# EAGLE design opemGBZv2 (EAGLE 9.1.0)

## Sheet 1 of 2: Button PCB and Audio
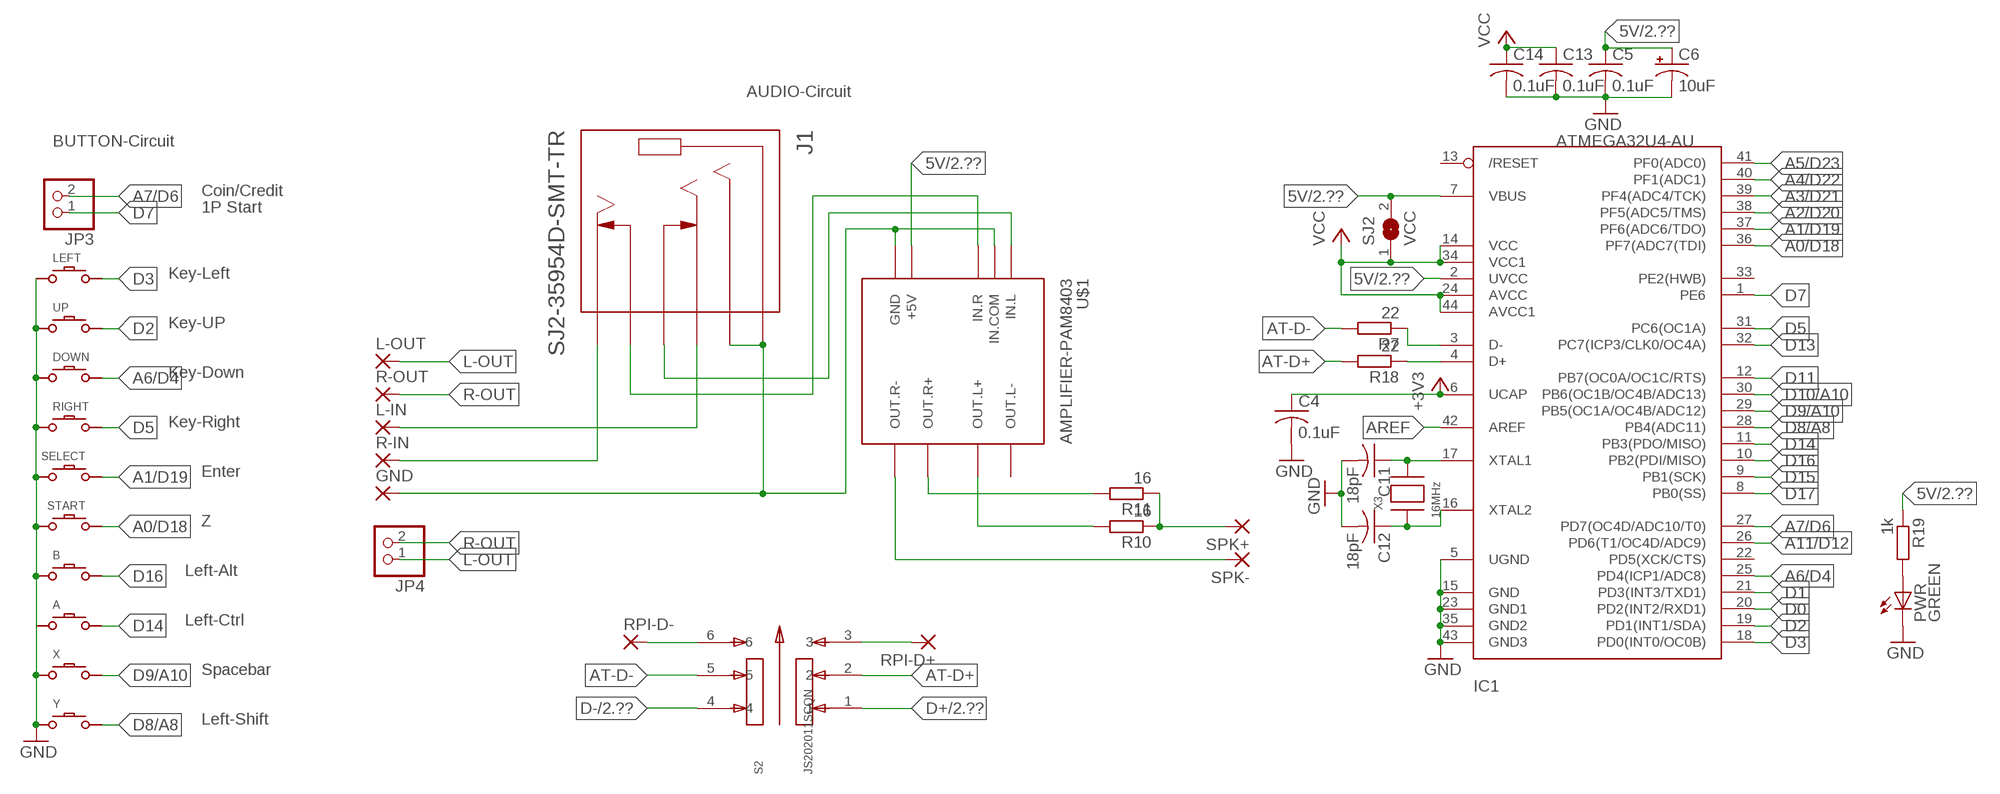
[diagram p0: schematic, sheet 1]

### Parts
A  DMG-BTN  DMG-BTNREGULAR  [DMG-BTN]
B  DMG-BTN  DMG-BTNREGULAR  [DMG-BTN]
C4  0.1uF  C-USC0805K  [C0805K]
C5  0.1uF  C-USC0805K  [C0805K]
C6  10uF  CPOL-USA/3216-18R  [A/3216-18R]
C11  18pF  C-USC0805K  [C0805K]
C12  18pF  C-USC0805K  [C0805K]
C13  0.1uF  C-USC0805K  [C0805K]
C14  0.1uF  C-USC0805K  [C0805K]
DOWN  DMG-BTN  DMG-BTNREGULAR  [DMG-BTN]
GND  WIREPADSMD1,27-254  [SMD1,27-2,54]
IC1  ATMEGA32U4-AU  [TQFP44]
J1  SJ2-35954D-SMT-TR  [CUI_SJ2-35954D-SMT-TR]
JP3  PINHD-1X2  [1X02]
JP4  PINHD-1X2  [1X02]
L-IN  WIREPADSMD1,27-254  [SMD1,27-2,54]
L-OUT  WIREPADSMD1,27-254  [SMD1,27-2,54]
LEFT  DMG-BTN  DMG-BTNREGULAR  [DMG-BTN]
PWR  GREEN  LEDCHIPLED_0805  [CHIPLED_0805]
R7  22  R-EU_R0603  [R0603]
R10  16  R-EU_R0603  [R0603]
R11  16  R-EU_R0603  [R0603]
R18  22  R-EU_R0603  [R0603]
R19  1k  R-EU_R0603  [R0603]
R-IN  WIREPADSMD1,27-254  [SMD1,27-2,54]
R-OUT  WIREPADSMD1,27-254  [SMD1,27-2,54]
RIGHT  DMG-BTN  DMG-BTNREGULAR  [DMG-BTN]
RPI-D+  WIREPADSMD1,27-254  [SMD1,27-2,54]
RPI-D-  WIREPADSMD1,27-254  [SMD1,27-2,54]
S2  JS202011SCQN  [SW_JS202011SCQN]
SELECT  DMG-BTN  DMG-BTNSELECT  [DMG-SEL]
SJ2  VCC  SJ  [SJ]
SPK+  WIREPADSMD1,27-254  [SMD1,27-2,54]
SPK-  WIREPADSMD1,27-254  [SMD1,27-2,54]
START  DMG-BTN  DMG-BTNSELECT  [DMG-SEL]
U$1  AMPLIFIER-PAM8403  [AMPLIFIER-PAM8403]
UP  DMG-BTN  DMG-BTNREGULAR  [DMG-BTN]
X  DMG-BTN  DMG-BTNREGULAR  [DMG-BTN]
X3  16MHz  XTALNX5032  [NX5032]
Y  DMG-BTN  DMG-BTNREGULAR  [DMG-BTN]

### Nets
5V: C5.1 C6.+ IC1.2(UVCC) IC1.7(VBUS) R19.1 SJ2.2 U$1.+5V ; also sheet 2
+3V3: C4.1 IC1.6(UCAP)
A0/D18: IC1.36(PF7(ADC7(TDI)) START.P$1
A1/D19: IC1.37(PF6(ADC6/TDO)) SELECT.P$1
A2/D20: IC1.38(PF5(ADC5/TMS))
A3/D21: IC1.39(PF4(ADC4/TCK))
A4/D22: IC1.40(PF1(ADC1))
A5/D23: IC1.41(PF0(ADC0))
A6/D4: DOWN.P$2 IC1.25(PD4(ICP1/ADC8))
A7/D6: IC1.27(PD7(OC4D/ADC10/T0)) JP3.2
A11/D12: IC1.26(PD6(T1/OC4D/ADC9))
AREF: IC1.42(AREF)
AT-D+: R18.2 S2.2
AT-D-: R7.2 S2.5
D0: IC1.20(PD2(INT2/RXD1))
D1: IC1.21(PD3(INT3/TXD1))
D2: IC1.19(PD1(INT1/SDA)) UP.P$2
D3: IC1.18(PD0(INT0/OC0B)) LEFT.P$2
D5: IC1.31(PC6(OC1A)) RIGHT.P$2
D7: IC1.1(PE6) JP3.1
D8/A8: IC1.28(PB4(ADC11)) Y.P$2
D9/A10: IC1.29(PB5(OC1A/OC4B/ADC12)) X.P$2
D10/A10: IC1.30(PB6(OC1B/OC4B/ADC13))
D11: IC1.12(PB7(OC0A/OC1C/RTS))
D13: IC1.32(PC7(ICP3/CLK0/OC4A))
D14: A.P$2 IC1.11(PB3(PDO/MISO))
D15: IC1.9(PB1(SCK))
D16: B.P$2 IC1.10(PB2(PDI/MISO))
D17: IC1.8(PB0(SS))
D+: S2.1 ; also sheet 2
D-: S2.4 ; also sheet 2
GND: A.P$1 B.P$1 C4.2 C5.2 C6.- C11.2 C12.2 C13.2 C14.2 DOWN.P$1 IC1.5(UGND) IC1.15(GND) IC1.23(GND1) IC1.35(GND2) IC1.43(GND3) LEFT.P$1 PWR.C RIGHT.P$1 SELECT.P$2 START.P$2 UP.P$1 X.P$1 Y.P$1 ; also sheet 2
L-OUT: JP4.1 L-OUT.1(P)
N$1: RPI-D-.1(P) S2.6
N$2: RPI-D+.1(P) S2.3
N$21: R11.2 U$1.OUT.R+
N$22: GND.1(P) J1.1(SLEEVE) J1.4(RING2) U$1.GND U$1.IN.COM
N$23: J1.11(RING1_SWITCH) U$1.IN.L
N$24: J1.10(TIP_SWITCH) U$1.IN.R
N$25: J1.2(TIP) R-IN.1(P)
N$26: J1.3(RING1) L-IN.1(P)
N$27: R10.2 U$1.OUT.L+
N$28: R10.1 R11.1 SPK+.1(P)
N$29: SPK-.1(P) U$1.OUT.R-
N$41: IC1.3(D-) R7.1
N$42: IC1.4(D+) R18.1
N$43: C12.1 IC1.16(XTAL2) X3.P$1
N$44: C11.1 IC1.17(XTAL1) X3.P$2
N$45: PWR.A R19.2
R-OUT: JP4.2 R-OUT.1(P)
VCC: C13.1 C14.1 IC1.14(VCC) IC1.24(AVCC) IC1.34(VCC1) IC1.44(AVCC1) SJ2.1 ; also sheet 2
Unconnected: IC1.13(/RESET) IC1.22(PD5(XCK/CTS)) IC1.33(PE2(HWB)) U$1.OUT.L-

### Notes on the sheet
- AUDIO-Circuit
- BUTTON-Circuit
- Coin/Credit
- 1P Start
- Key-Left
- Key-UP
- Key-Down
- Key-Right
- Enter
- Z
- Left-Alt
- Left-Ctrl
- Spacebar
- Left-Shift

## Sheet 2 of 2: Batterie Charging/Boosting/Protection
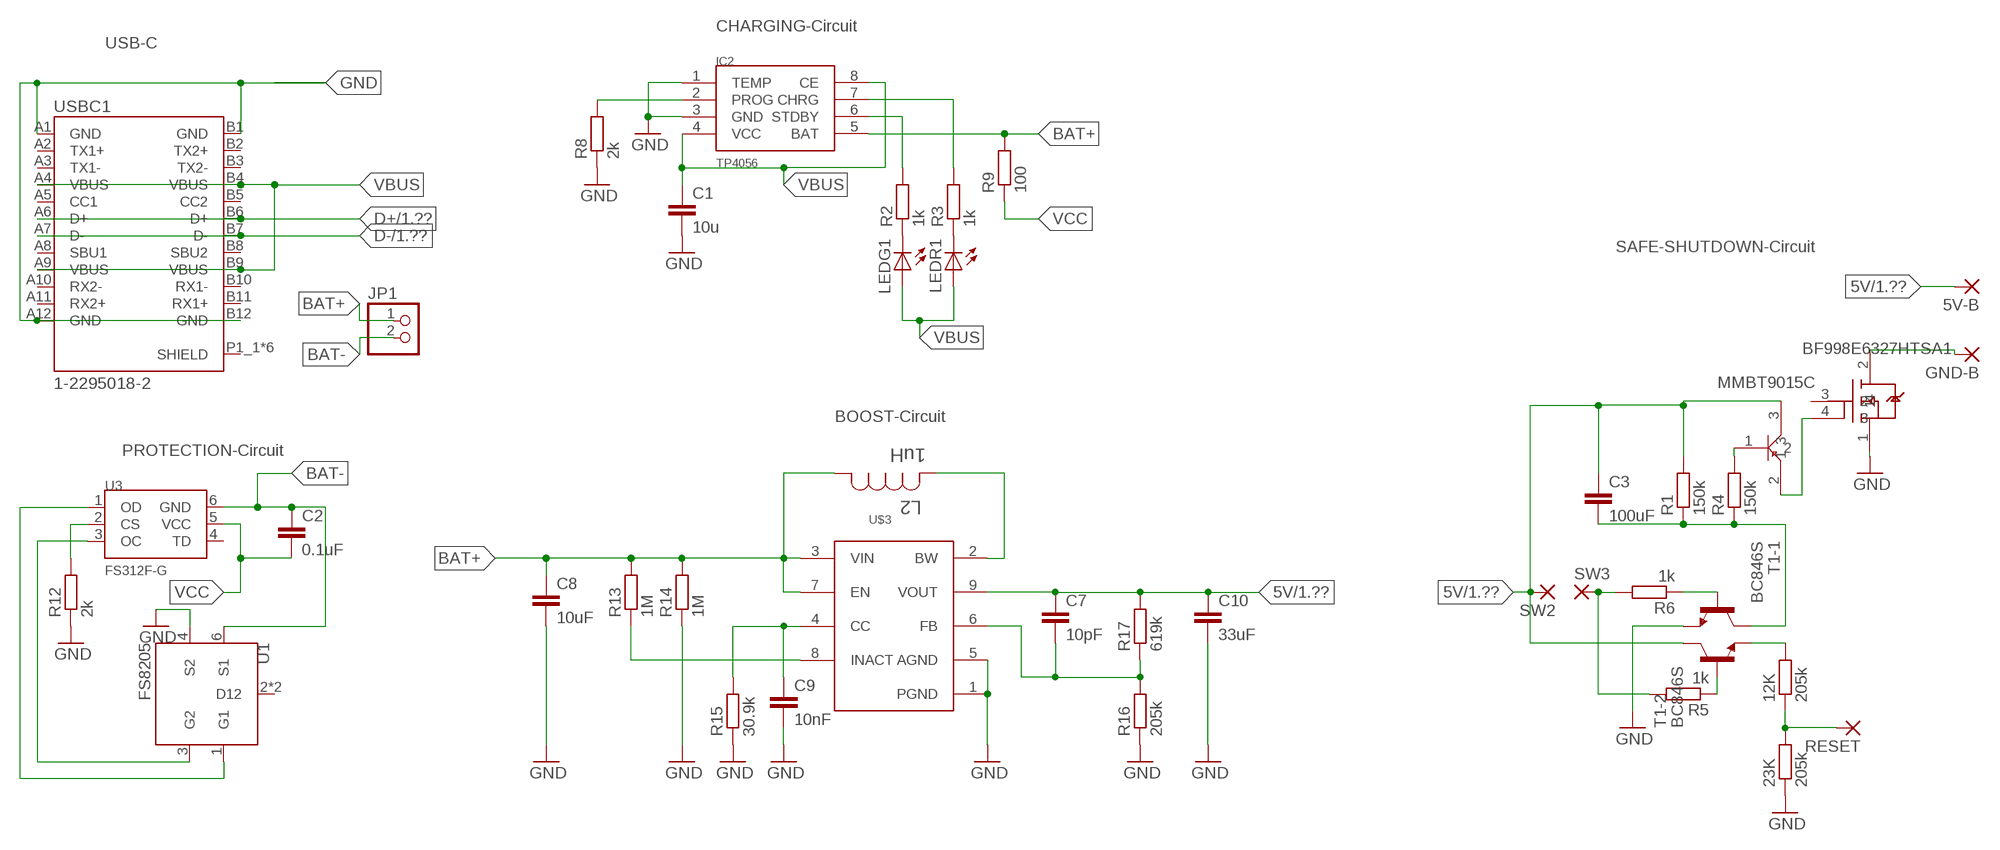
[diagram p1: schematic, sheet 2]

### Parts
5V-B  WIREPADSMD1,27-254  [SMD1,27-2,54]
12K  205k  R-EU_R0603  [R0603]
23K  205k  R-EU_R0603  [R0603]
BF998E6327HTSA1  INF-SOT143-4-1_V_1  [INF-SOT143-4-1_V_1PRIMARY]
C1  10u  C-EUC0603  [C0603]
C2  0.1uF  C-EUC0603  [C0603]
C3  100uF  C-EUC1812  [C1812]
C7  10pF  C-EUC1812  [C1812]
C8  10uF  C-EUC1812  [C1812]
C9  10nF  C-EUC1812  [C1812]
C10  33uF  C-EUC1812  [C1812]
GND-B  WIREPADSMD1,27-254  [SMD1,27-2,54]
IC2  TP4056  [SOP-8]
JP1  PINHD-1X2  [1X02]
L2  1uH  DR74-220-R  [INDM7676X435N]
LEDG1  LEDCHIP-LED0603  [CHIP-LED0603]
LEDR1  LEDCHIP-LED0603  [CHIP-LED0603]
MMBT9015C  INF-SOT23_M_1  [INF-SOT23_M_1PRIMARY]
R1  150k  R-EU_R0603  [R0603]
R2  1k  R-EU_R0603  [R0603]
R3  1k  R-EU_R0603  [R0603]
R4  150k  R-EU_R0603  [R0603]
R5  1k  R-EU_R0603  [R0603]
R6  1k  R-EU_R0603  [R0603]
R8  2k  R-EU_R0603  [R0603]
R9  100  R-EU_R0603  [R0603]
R12  2k  R-EU_R0603  [R0603]
R13  1M  R-EU_R0603  [R0603]
R14  1M  R-EU_R0603  [R0603]
R15  30.9k  R-EU_R0603  [R0603]
R16  205k  R-EU_R0603  [R0603]
R17  619k  R-EU_R0603  [R0603]
RESET  WIREPADSMD1,27-254  [SMD1,27-2,54]
SW2  WIREPADSMD1,27-254  [SMD1,27-2,54]
SW3  WIREPADSMD1,27-254  [SMD1,27-2,54]
T1  BC846S  [SOT363]
U1  FS8205  [SOT23-6]
U3  FS312F-G  [SOT23-6]
U$3  TPS61235RWLR  CONV_TPS61235RWLR  [CONV_TPS61235RWLR]
USBC1  1-2295018-2  [TE_1-2295018-2]

### Nets
5V: 5V-B.1(P) C3.1 C7.1 C10.1 MMBT9015C.3 R1.2 R17.2 SW2.1(P) T1.3(-2:C) U$3.9(VOUT) ; also sheet 1
BAT+: C8.1 IC2.5(BAT) JP1.1 L2.1 R9.2 R13.2 R14.2 U$3.3(VIN) U$3.7(EN)
BAT-: C2.1 JP1.2 U1.6(S1) U3.6(GND)
D+: USBC1.A6(D+) USBC1.B6(D+) ; also sheet 1
D-: USBC1.A7(D-) USBC1.B7(D-) ; also sheet 1
GND: 23K.1 BF998E6327HTSA1.1 C1.2 C8.2 C9.2 C10.2 IC2.1(TEMP) IC2.3(GND) R8.1 R12.1 R14.1 R15.1 R16.1 T1.1(-1:E) U1.4(S2) U$3.1(PGND) U$3.5(AGND) USBC1.A1(GND) USBC1.A12(GND) USBC1.B1(GND) USBC1.B12(GND) ; also sheet 1
N$11: BF998E6327HTSA1.2 GND-B.1(P)
N$12: BF998E6327HTSA1.4 MMBT9015C.2
N$13: MMBT9015C.1 R4.2
N$14: 12K.2 T1.4(-2:E)
N$15: C3.2 R1.1 R4.1 T1.6(-1:C)
N$16: R6.1 T1.2(-1:B)
N$17: R5.2 R6.2 SW3.1(P)
N$18: R5.1 T1.5(-2:B)
N$19: R13.1 U$3.8(INACT)
N$20: C9.1 R15.2 U$3.4(CC)
N$30: IC2.6(STDBY) R2.2
N$31: IC2.7(CHRG) R3.2
N$32: LEDG1.C R2.1
N$33: L2.2 U$3.2(BW)
N$34: LEDR1.C R3.1
N$35: C7.2 R16.2 R17.1 U$3.6(FB)
N$36: IC2.2(PROG) R8.2
N$37: U1.3(G2) U3.3(OC)
N$38: U1.1(G1) U3.1(OD)
N$39: R12.2 U3.2(CS)
N$40: 12K.1 23K.2 RESET.1(P)
VBUS: C1.1 IC2.4(VCC) IC2.8(CE) LEDG1.A LEDR1.A USBC1.A4(VBUS) USBC1.A9(VBUS) USBC1.B4(VBUS) USBC1.B9(VBUS)
VCC: C2.2 R9.1 U3.5(VCC) ; also sheet 1
Unconnected: BF998E6327HTSA1.3 U1.2(D12) U1.5(D12) U3.4(TD) USBC1.A2(TX1+) USBC1.A3(TX1-) USBC1.A5(CC1) USBC1.A8(SBU1) USBC1.A10(RX2-) USBC1.A11(RX2+) USBC1.B2(TX2+) USBC1.B3(TX2-) USBC1.B5(CC2) USBC1.B8(SBU2) USBC1.B10(RX1-) USBC1.B11(RX1+) USBC1.P1_1(SHIELD) USBC1.P1_2(SHIELD) USBC1.P2_1(SHIELD) USBC1.P2_2(SHIELD) USBC1.P4(SHIELD) USBC1.P5(SHIELD)

### Notes on the sheet
- CHARGING-Circuit
- USB-C
- SAFE-SHUTDOWN-Circuit
- BOOST-Circuit
- PROTECTION-Circuit

## Library data of the parts
5V-B GND GND-B L-IN L-OUT R-IN R-OUT RESET RPI-D+ RPI-D- SPK+ SPK- SW2 SW3 = wirepad:WIREPAD: Wire PAD connect wire on PCB
12K 23K R1-R19 = rcl:R-EU_: RESISTOR, European symbol; SPICEPREFIX: R
A B DOWN LEFT RIGHT SELECT START UP X Y = Game Boy:DMG-BTN
BF998E6327HTSA1 = INF-SOT143-4-1_V:INF-SOT143-4-1_V_1
C1-C3 C7-C10 = rcl:C-EU: CAPACITOR, European symbol; SPICEPREFIX: C
C4 C5 C11-C14 = adafruit:C-US: CAPACITOR, American symbol
C6 = adafruit:CPOL-US: POLARIZED CAPACITOR, American symbol
IC1 = adaprog:ATMEGA32U4
IC2 = TP4056:TP4056
J1 = SJ2-35954D-SMT-TR:SJ2-35954D-SMT-TR: 4 conductors, 3.5mm, SMT Audio Jack w/ 2 Switch; AVAILABILITY: Good; DESCRIPTION: 4 conductors, 3.5mm, SMT Audio Jack w/ 2 Switch; MF: CUI; MP: SJ2-35954D-SMT-TR; PACKAGE: None; PRICE: 0.94 USD
JP1 JP3 JP4 = pinhead:PINHD-1X2: PIN HEADER
L2 = DR74-220-R:DR74-220-R: POWER INDUCTOR; AVAILABILITY: Good; DESCRIPTION: Inductor Power Shielded Drum Core 21.73uH/22uH 20% 100KHz Ferrite 1.75A 92.5mOhm DCR T/R; MF: Eaton; MP: DR74-220-R; PACKAGE: Nonstandard Eaton; PRICE: 0.98 USD
LEDG1 LEDR1 = led:LED: LED
MMBT9015C = INF-SOT23_M:INF-SOT23_M_1
PWR = adafruit:LED: LED
S2 = JS202011SCQN:JS202011SCQN: JS Series DPDT On-On Gull Wing Surface Mount Subminiature Slide Switch; AVAILABILITY: Unavailable; DESCRIPTION: JS Series DPDT On-On Gull Wing Surface Mount Subminiature Slide Switch; MF: C&K Components; MP: JS202011SCQN; PACKAGE: None; PRICE: None
SJ2 = jumper:SJ: SMD solder JUMPER
T1 = nxp_60:BC846S: Dual 65 V, 100 mA NPN/NPN general-purpose transistor AAL Eindhoven MK
U1 = fs8205:FS8205
U3 = fs321f-g:FS312F-G
U$1 = diy-modules:AMPLIFIER-PAM8403: Stereo Class-D 3W Audio Amplifier based on PAM8403 chip More details available here: http://artofcircuits.com/product/pam8403-5v-two-channel-stereo-mini-class-d-3w3w-audio-amplifier Click here to find device on ebay.com <http://www.ebay.com/sch/pam8403+mini+class+d>
U$3 = CONV_TPS61235RWLR:CONV_TPS61235RWLR
USBC1 = 1-2295018-2:1-2295018-2: SPLASH PROOF USB TYPE C REC, DUAL SMT; Tape/Reel of 900; AVAILABILITY: Good; CENTERLINE_PITCH: .5 mm[.019 in]; COMMENT: 1-2295018-2; DESCRIPTION: USB TYPE C, REC OFFSET 0.65MM DUAL SMT; MF: TE Connectivity; MP: 1-2295018-2; NUMBER_OF_POSITIONS: 24; PACKAGE: None; PRICE: 1.82 USD; PRODUCT_TYPE: Connector
X3 = adaprog:XTAL

## Board
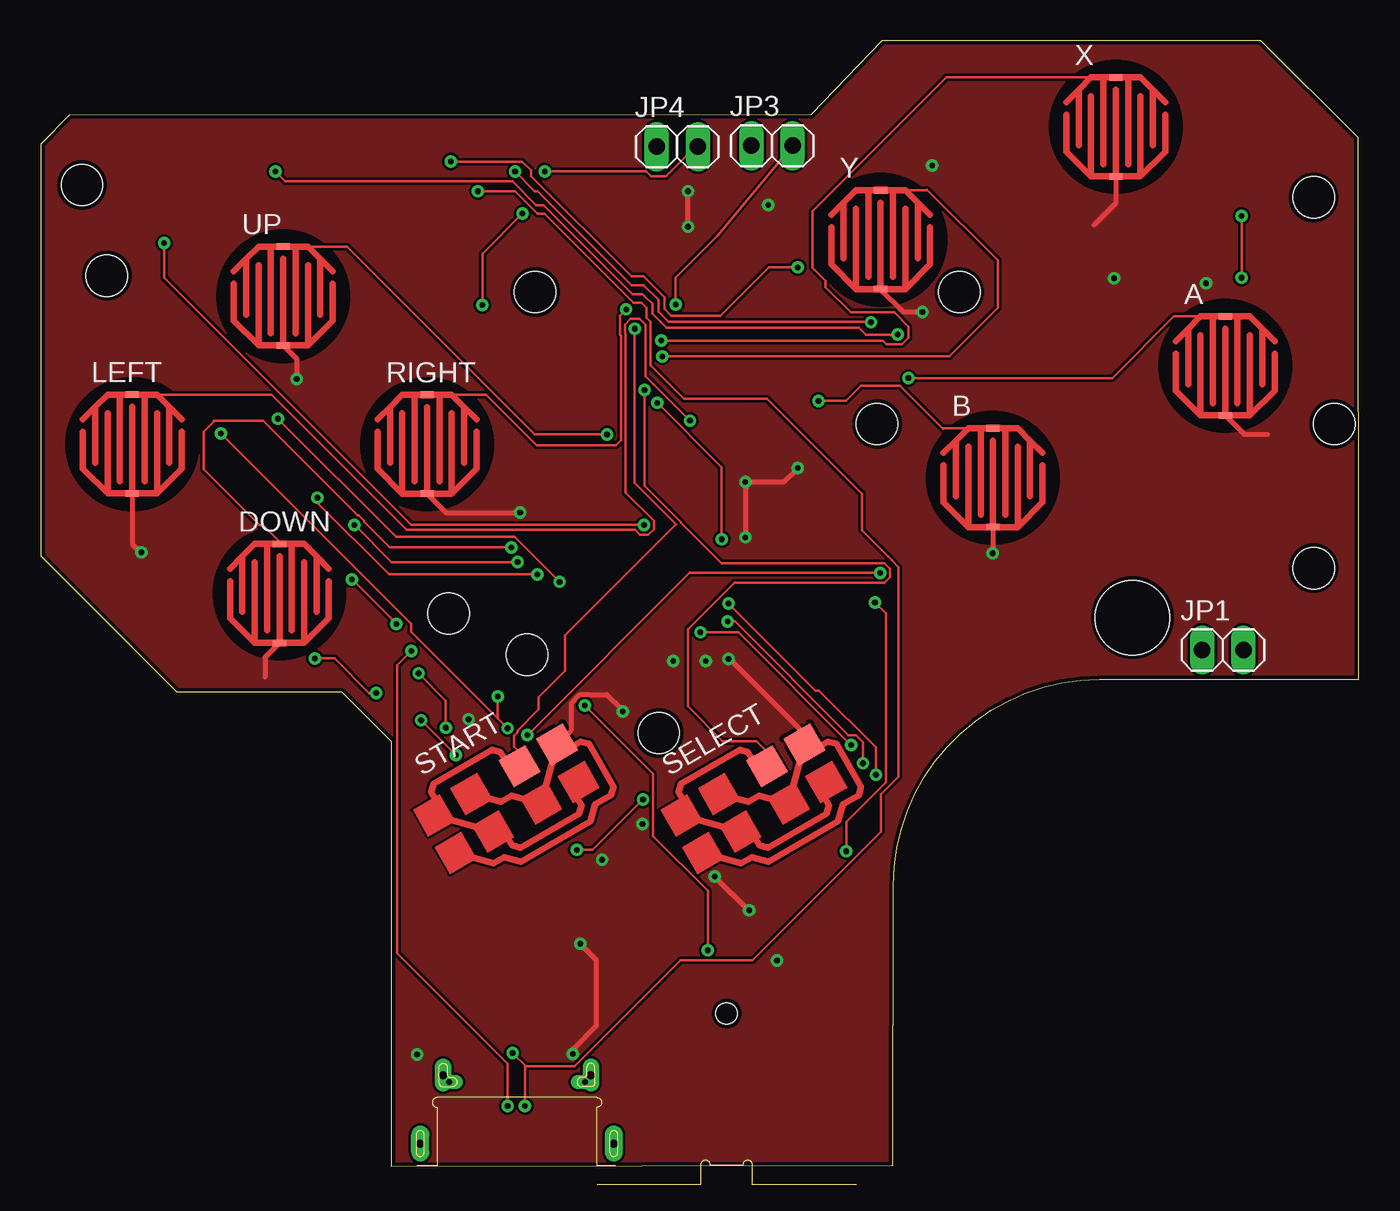
[diagram p2: board, top side]
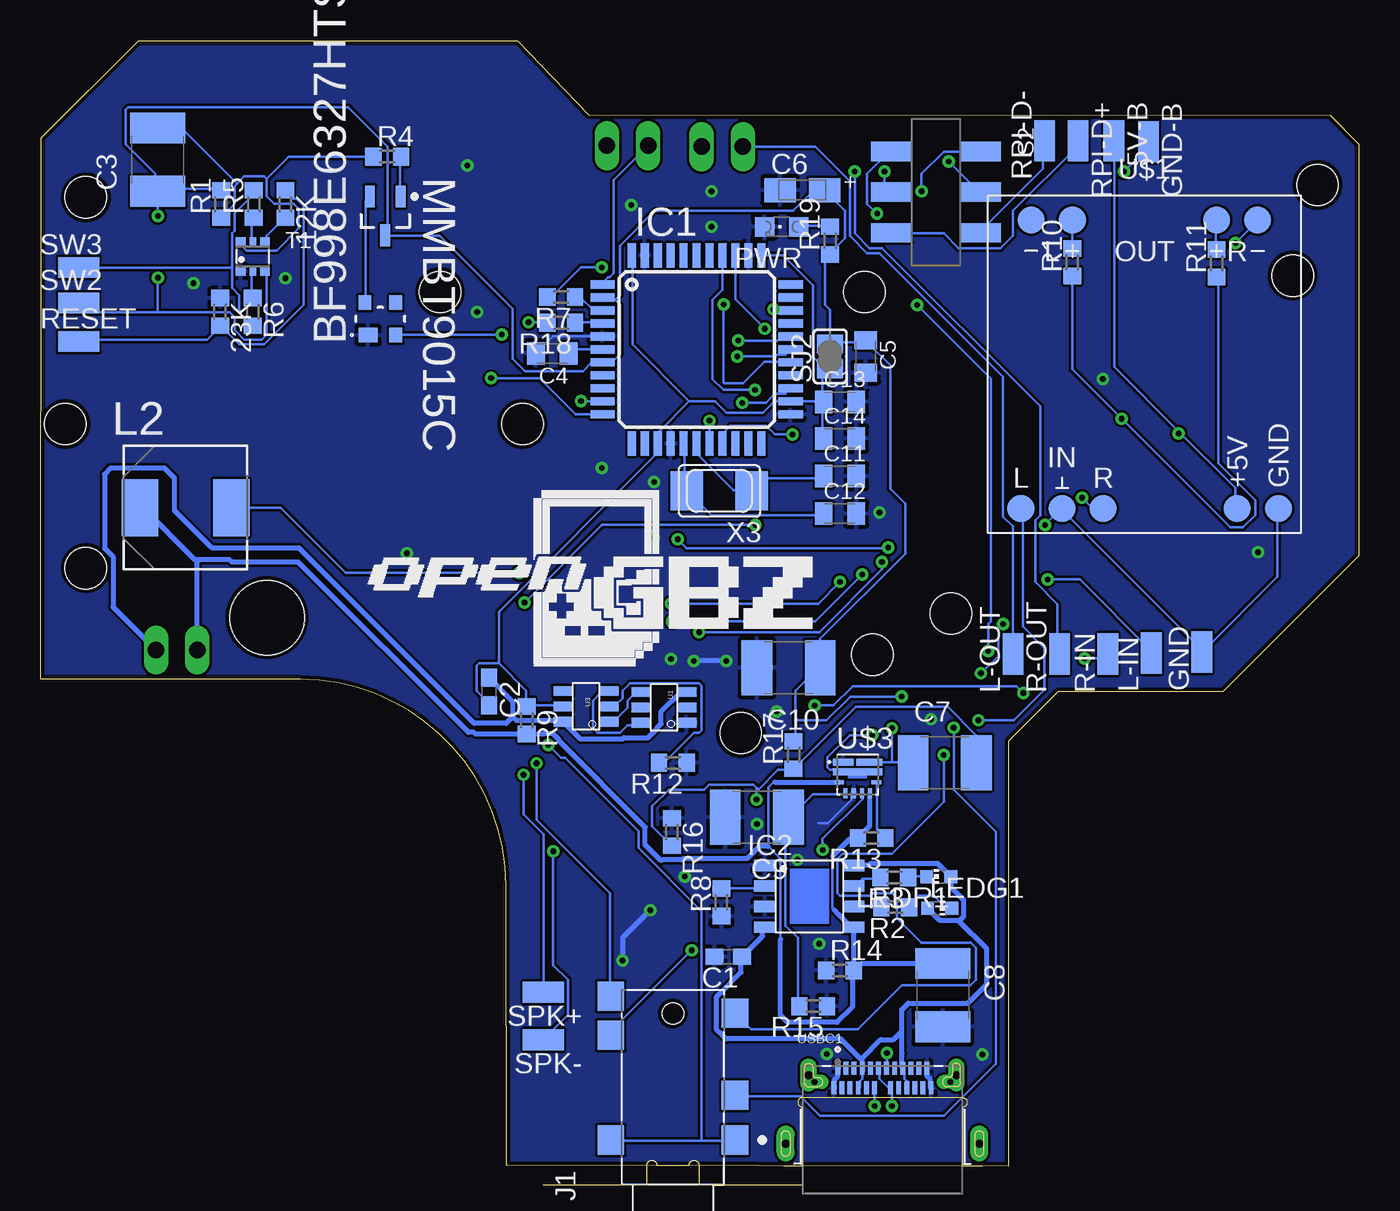
[diagram p3: board, bottom side, seen from below]

Size 81.3 x 69.38 mm. Coordinates in mm from the lower left corner, seen from the top.
Outline: 75.24,69.38 51.89,69.37 47.52,64.8 1.78,64.77 0,62.99 0.02,37.62 8.4,29.24 18.56,29.24 21.61,26.19 21.61,14.13 21.61,14.02 21.62,0 52.51,0.05 52.57,0.05 52.6,17.26 52.6,17.3 arc-90 65.3,30 81.3,30 81.26,63.03 81.26,63.05 81.26,63.3 81.26,63.3 81.26,63.36 81.25,63.37 81.25,63.37 75.24,69.38
Copper layers (1*16): Top 0.035mm / dielectric 1.5mm / Bottom 0.035mm
Design rules "default *": minimum track width 6mil, minimum drill 0.35mm, track to track 6mil, track to pad 6mil, pad to pad 6mil, via to via 6mil, smd to smd 6mil, copper to edge 10mil, drill to drill 6mil, minimum pad ring 10mil, minimum via ring 8mil, stop-mask expansion 4mil, vias tented up to drill 0mil, thermal gap 10mil
Holes 4.57 mm at 67.33,33.81
Holes 2.54 mm at 2.56,60.48 78.5,59.72 78.5,36.86 30.5,53.87 56.66,53.87 29.99,31.52 51.58,45.75 25.16,34.06 38.12,26.7 79.77,45.75 4.08,54.89

### Footprints (pad centres in the part's own frame; a part is rotated, then mirrored left to right if it is on the bottom)
SMD1,27-2,54 = smd 1.27 x 2.54: 1 0,0
R0603 = smd 1 x 1.1: 1 -0.85,0; 2 0.85,0
DMG-BTN = smd 0.813 x 0.406: P$1 0,-3.048; P$2 0,3.048
INF-SOT143-4-1_V_1PRIMARY = smd 0.9 x 1.2: 1 -1,0.75 | smd 0.9 x 0.8: 2 -1,-0.95; 3 1,-0.95; 4 1,0.95
C0603 = smd 1.1 x 1: 1 -0.85,0; 2 0.85,0
C1812 = smd 1.9 x 3.4: 1 -1.95,0; 2 1.95,0
C0805K = smd 1.1 x 1.4: 1 -1,0; 2 1,0
A/3216-18R = smd 1.95 x 1.5: + 1.375,0; - -1.375,0
TQFP44 = smd 1.5 x 0.5: 1 -5.8,4; 2 -5.8,3.2; 3 -5.8,2.4; 4 -5.8,1.6; 5 -5.8,0.8; 6 -5.8,0; 7 -5.8,-0.8; 8 -5.8,-1.6; 9 -5.8,-2.4; 10 -5.8,-3.2; 11 -5.8,-4; 23 5.8,-4; 24 5.8,-3.2; 25 5.8,-2.4; 26 5.8,-1.6; 27 5.8,-0.8; 28 5.8,0; 29 5.8,0.8; 30 5.8,1.6; 31 5.8,2.4; 32 5.8,3.2; 33 5.8,4 | smd 0.5 x 1.5: 12 -4,-5.8; 13 -3.2,-5.8; 14 -2.4,-5.8; 15 -1.6,-5.8; 16 -0.8,-5.8; 17 0,-5.8; 18 0.8,-5.8; 19 1.6,-5.8; 20 2.4,-5.8; 21 3.2,-5.8; 22 4,-5.8; 34 4,5.8; 35 3.2,5.8; 36 2.4,5.8; 37 1.6,5.8; 38 0.8,5.8; 39 0,5.8; 40 -0.8,5.8; 41 -1.6,5.8; 42 -2.4,5.8; 43 -3.2,5.8; 44 -4,5.8
SOP-8 = smd 1.3 x 0.7: 1 -2.75,1.905; 2 -2.75,0.635; 3 -2.75,-0.635; 4 -2.75,-1.905; 5 2.75,-1.905; 6 2.75,-0.635; 7 2.75,0.635; 8 2.75,1.905
CUI_SJ2-35954D-SMT-TR = smd 1.8 x 1.65: 1 -3.25,-3.825; 2 3.2,3.825; 3 -0.5,-3.825; 4 -3.25,3.825; 10 5.6,3.825; 11 4.55,-3.825 | hole 1.3: 4.55,0
1X02 = drill 1.016 long: 1 -1.27,0; 2 1.27,0
INDM7676X435N = smd 2.261 x 3.505: 1 -2.819,0; 2 2.819,0
CHIP-LED0603 = smd 0.8 x 0.8: A 0,-0.75; C 0,0.75
INF-SOT23_M_1PRIMARY = smd 1.35 x 0.6: 1 -1.2,0.95; 2 -1.2,-0.95; 3 1.2,0
CHIPLED_0805 = smd 1.2 x 1.2: A 0,-1.05; C 0,1.05
SW_JS202011SCQN = smd 1.2 x 2.5: 1 -2.5,-2.75; 2 0,-2.75; 3 2.5,-2.75; 4 -2.5,2.75; 5 0,2.75; 6 2.5,2.75
DMG-SEL = smd 1.905 x 1.905: P$1 1.714,1.333; P$2 4.381,1.333
SJ = smd 1.168 x 1.6: 1 -0.762,0; 2 0.762,0
SOT363 = smd 0.6 x 0.6: 1 -0.75,-0.9; 3 0.75,-0.9; 4 0.75,0.9; 6 -0.75,0.9 | smd 0.4 x 0.6: 2 0,-0.9; 5 0,0.9
SOT23-6 = smd 0.6 x 1.2: 1 -0.95,-1.4; 2 0,-1.4; 3 0.95,-1.4; 4 0.95,1.4; 5 0,1.4; 6 -0.95,1.4
AMPLIFIER-PAM8403 = smd 1.676 x 1.676: +5V 5.715,-8.89; GND 8.255,-8.89; IN.COM -5.08,-8.89; IN.L -7.62,-8.89; IN.R -2.54,-8.89; OUT.L+ -4.445,8.89; OUT.L- -6.985,8.89; OUT.R+ 4.445,8.89; OUT.R- 6.985,8.89
CONV_TPS61235RWLR = smd 1.24 x 0.44: 1 -0.9,0.77 | smd 3.04 x 0.44: 2 0,0.17 | smd 0.6 x 0.25: 3 -1.15,-0.475; 8 1.15,-0.475 | smd 0.25 x 0.6: 4 -0.75,-1.15; 5 -0.25,-1.15; 6 0.25,-1.15; 7 0.75,-1.15 | smd 1.59 x 0.44: 9 0.725,0.77
TE_1-2295018-2 = smd 0.3 x 0.8: A1 -2.75,4.63; A2 -2.25,4.63; A3 -1.75,4.63; A4 -1.25,4.63; A5 -0.75,4.63; A6 -0.25,4.63; A7 0.25,4.63; A8 0.75,4.63; A9 1.25,4.63; A10 1.75,4.63; A11 2.25,4.63; A12 2.75,4.63; B1 3,3.43; B2 2.5,3.43; B3 2,3.43; B4 1.5,3.43; B5 1,3.43; B6 0.5,3.43; B7 -0.5,3.43; B8 -1,3.43; B9 -1.5,3.43; B10 -2,3.43; B11 -2.5,3.43; B12 -3,3.43 | drill 0.5 long: P1_1 -4.55,4.22; P2_1 4.55,4.22 | drill 0.35 long: P1_2 -4.191,3.795; P2_2 4.191,3.795 | drill 0.5 pad 1.1 long: P4 -5.97,0; P5 5.97,0
NX5032 = smd 2 x 2.4: P$1 2,0; P$2 -2,0

### Placement (x,y rotation side)
5V-B  15.12,63.2 180 bottom
12K  66.2,59.3 270 bottom
23K  70.22,52.66 270 bottom
A  73.05,49.32 0 top
B  58.73,42.43 0 top
BF998E6327HTSA1  60.35,52.23 90 bottom
C1  38.89,12.91 180 bottom
C2  53.64,29.25 270 bottom
C3  74.06,62.04 90 bottom
C4  49.74,50.09 180 bottom
C5  30.42,49.91 270 bottom
C6  34.32,60.15 0 bottom
C7  25.54,24.86 0 bottom
C8  25.66,10.53 270 bottom
C9  37.12,21.5 180 bottom
C10  35.17,30.71 180 bottom
C11  32,42.54 0 bottom
C12  32,40.22 0 bottom
C13  32,47.11 0 bottom
C14  32,44.85 0 bottom
DOWN  14.73,35.3 0 top
GND  9.69,31.68 0 bottom
GND-B  12.98,63.14 180 bottom
IC1  40.84,50.34 0 bottom
IC2  33.89,16.63 0 bottom
J1  42.3,4.86 90 bottom
JP1  72.91,31.81 0 top
JP3  45.11,62.9 0 top
JP4  39.26,62.84 0 top
L2  72.36,40.58 0 bottom
L-IN  12.8,31.62 0 bottom
L-OUT  21.33,31.56 0 bottom
LEDG1  25.85,15.9 270 bottom
LEDR1  25.91,17.85 90 bottom
LEFT  5.66,44.51 0 top
MMBT9015C  60.04,58.57 270 bottom
PWR  35.6,57.9 90 bottom
R1  70.16,59.3 90 bottom
R2  28.59,15.96 180 bottom
R3  28.65,17.79 180 bottom
R4  59.92,62.23 0 bottom
R5  68.15,59.3 90 bottom
R6  68.21,52.66 270 bottom
R7  49.19,53.57 180 bottom
R8  39.32,16.26 90 bottom
R9  51.33,27.48 270 bottom
R10  17.68,55.71 90 bottom
R11  8.78,55.65 90 bottom
R12  42.3,24.86 180 bottom
R13  30.05,20.22 180 bottom
R14  32,12.06 0 bottom
R15  33.65,9.86 180 bottom
R16  42.37,20.59 270 bottom
R17  34.87,25.34 90 bottom
R18  49.19,51.98 180 bottom
R19  32.61,57.04 90 bottom
R-IN  15.48,31.56 0 bottom
R-OUT  18.47,31.56 0 bottom
RESET  78.94,50.83 270 bottom
RIGHT  23.83,44.5 0 top
RPI-D+  17.31,63.2 180 bottom
RPI-D-  19.38,63.2 0 bottom
S2  26.09,60.03 270 bottom
SELECT  43.98,22.64 30 top
SJ2  32.61,49.91 90 bottom
SPK+  50.29,10.71 90 bottom
SPK-  50.29,7.79 90 bottom
START  28.72,22.64 30 top
SW2  78.94,53.2 270 bottom
SW3  78.94,55.4 270 bottom
T1  68.21,56.07 0 bottom
U1  42.85,28.27 270 bottom
U3  47.67,28.33 90 bottom
U$1  13.23,49.42 0 bottom
U$3  30.91,24.13 0 bottom
UP  14.96,53.63 0 top
USBC1  29.38,1.39 0 bottom
X  66.3,64.05 0 top
X3  39.44,41.62 180 bottom
Y  51.8,57.11 0 top

### Tracks (layer width: path | path; a pad name or v marks a point on that pad's centre or on a via)
5V  (via drill 0.35)
  Top 0.152: v74.06,58.57 v74.06,54.76 | v11.12,45.16 22.86,33.42 22.86,32.93 v28.8,26.99 28.19,27.6 v28.19,28.94
  Bottom 0.152: 11.12,45.31 15.09,49.27 15.09,63.14 5V-B.1 | 11.12,45.31 7.62,41.8 7.62,40.58 U$1.+5V | 28.8,24.89 U$3.9 | C7.1 27.58,24.89 28.8,24.89 | 34.75,27.48 34.75,29.31 33.37,30.68 C10.1 33.22,30.83 33.22,32.51 27.98,37.75 27.98,40.83 28.89,41.74 28.89,49.18 28.8,49.27 30.33,50.8 C5.1 30.48,50.8 32.61,50.8 | 34.75,27.48 34.75,26.26 R17.2 | v28.8,26.99 28.8,24.89 | v28.19,28.94 31.36,28.94 32.83,27.48 34.75,27.48 | 74.06,52.62 78.48,52.62 78.94,53.08 SW2.1 | 74.06,52.62 69.65,52.62 69.34,52.32 69.34,51.56 68.73,50.95 67.66,50.95 67.36,51.25 67.36,55.06 T1.3 | 32.61,50.8 32.61,52.78 32.92,53.08 32.92,55.82 32.61,56.13 R19.1 32.61,56.28 31.7,57.2 31.7,58.87 32.92,60.09 C6.+ 33.07,60.09 33.68,60.09 34.9,58.87 43.43,58.87 45.57,56.74 45.57,53.69 45.87,53.39 | 32.61,50.8 SJ2.2 | R1.2 70.25,60.24 74.06,60.24 C3.1 | 46.79,49.42 IC1.7 | 45.87,53.39 46.63,53.39 IC1.2 | 45.87,53.39 45.57,53.08 45.57,50.03 46.02,49.58 46.63,49.58 IC1.7 | C3.1 74.22,60.24 74.22,61.16 76.05,62.99 76.05,65.12 75.89,65.27 62.33,65.27 59.89,62.83 59.89,57.5 MMBT9015C.3 59.89,57.35 56.69,57.35 52.18,52.84 52.18,49.76 51.42,49 47.85,49 47.31,49.54 IC1.7 | v74.06,54.76 74.06,52.62 | v74.06,58.57 C3.1 | v11.12,45.16 11.12,45.31
+3V3
  Bottom 0.152: C4.1 48.74,50.21 48.61,50.34 46.79,50.34 IC1.6
A0/D18  (via drill 0.35)
  Top 0.152: v36.64,51.62 36.64,42.11 39.2,39.55 32.35,32.71 32.35,30.54 30.72,28.91 30.72,28.15 29.41,26.84 29.41,26.74 29.2,26.53 29.2,25.83 29.54,25.49 START.P$1
  Bottom 0.152: IC1.36 38.44,53.42 v36.64,51.62
A1/D19  (via drill 0.35)
  Top 0.152: v37.25,47.84 37.25,41.93 39.5,39.67 42,37.17 52.04,37.17 52.39,36.81 52.39,36.31 52.04,35.95 42.8,35.95 39.93,33.09 39.93,28.33 42.06,26.2 44.13,26.2 44.8,25.53 SELECT.P$1
  Bottom 0.152: IC1.37 39.24,54.01 39.87,53.39 39.87,48.51 39.2,47.84 v37.25,47.84
A6/D4  (via drill 0.35)
  Top 0.152: v38.04,47.05 42,43.08 v42,38.63 | v29.03,38.13 23.97,38.13 23.96,38.15 21.52,38.15 19.96,39.7 19.96,39.77 19.6,40.12 19.54,40.12 13.71,45.95 10.67,45.95 10.67,45.89 10.06,45.28 10.06,42.96 13.51,39.51 13.61,39.51 13.65,39.55 14.73,38.47 DOWN.P$2
  Bottom 0.152: IC1.25 35.36,47.62 36.01,47.62 36.58,47.05 v38.04,47.05 | v42,38.63 41.45,38.09 28.83,38.09 28.79,38.13 | 28.77,38.15 28.79,38.13 | 28.79,38.13 v29.03,38.13
A7/D6  (via drill 0.35)
  Top 0.152: JP3.2 41.76,57.35 39.17,54.76 v39.17,53.11
  Bottom 0.152: IC1.27 35.05,49.58 36.67,49.58 37.98,48.27 39.13,48.27 39.2,48.33 39.2,49.49 39.2,53.08 v39.17,53.11
AT-D+  (via drill 0.35)
  Top 0.152: v29.26,61.31 30.48,60.09 30.66,60.09 36.45,54.3 37.18,54.3 38.1,53.39 38.1,52.65 38.71,52.04 51.17,52.04 v51.2,52.01
  Bottom 0.152: v51.2,52.01 50.14,52.01 R18.2 | v29.26,61.31 29.26,60.4 28.95,60.09 S2.2
AT-D-  (via drill 0.35)
  Top 0.152: v46.69,55.4 44.93,55.4 41.94,52.41 38.89,52.41 38.46,52.84 38.46,53.57 37.18,54.85 36.45,54.85 30.23,61.01 30.23,61.37 29.69,61.92 v25.3,61.92
  Bottom 0.152: v46.69,55.4 47.97,55.4 49.68,53.69 49.99,53.69 R7.2 | v25.3,61.92 23.47,60.09 S2.5
BAT+
  Bottom 0.152: 36.03,23.67 36.12,23.67 36.42,23.36 36.42,19.71 35.66,18.94 35.66,14.01 | 31.24,11.45 31.24,11.93 R14.2 | 43.01,18.85 43.52,19.37 | 42.79,18.82 43.04,18.82 | 31.24,12.54 31.24,12.09 R14.2 | 31.24,12.54 31.24,14.68 | 31.39,20.16 30.94,20.16 R13.2 | 32.46,19.1 32.46,15.9 32.35,15.79 31.24,14.68 | 31.24,14.68 IC2.5 | 31.24,12.54 25.75,12.54 C8.1 | 31.24,12.54 R14.2 | 74.98,40.58 75.13,40.58 L2.1 | 69.55,37.29 69.58,37.32 69.65,37.38
  Bottom 0.305: C8.1 30.69,12.48 31.24,11.93 | R14.2 31.15,14.71 IC2.5 31.3,14.72 32.1,15.52 32.1,15.53 32.35,15.79 | 31.24,11.45 31.24,9.8 32.19,8.85 35.23,8.85 35.66,9.28 35.66,14.01 | 36.42,19.71 36.97,19.71 37.73,18.94 41.68,18.94 41.75,18.87 42.98,18.87 43.01,18.85 43.04,18.82 44.01,19.8 44.01,20.89 49.3,26.19 49.3,26.24 49.7,26.64 50.27,26.64 50.28,26.63 R9.2 54.47,26.63 54.57,26.73 54.91,26.73 65.41,37.23 69.49,37.23 69.55,37.29 | 36.03,23.67 32.07,23.67 U$3.3 | 69.65,37.38 71.78,37.38 | 71.78,37.38 74.98,40.58 | 74.98,40.58 | 32.46,19.1 31.39,20.16 | U$3.7 30.16,20.97 R13.2 | 69.58,37.31 69.58,37.32 | JP1.1 71.64,37.24 71.78,37.38
BAT-
  Bottom 0.152: 49.25,27.48 49.07,27.48 U3.6
  Bottom 0.305: C2.1 52.18,28.63 52.18,27.7 | 49.25,27.48 51.96,27.48 52.18,27.7 | U3.6 48.02,26.34 45.41,26.34 45.33,26.41 43.83,26.41 43.28,26.96 43.28,27.02 43.04,27.26 43.04,28.03 41.84,29.22 U1.6 | 52.18,27.7 52.59,27.3 54.56,27.3 65.35,38.09 70.71,38.09 73.03,40.4 73.03,42.41 73.64,43.02 76.99,43.02 77.36,42.66 77.36,38.08 76.83,37.55 76.83,34.46 JP1.2
D2  (via drill 0.35)
  Top 0.152: UP.P$2 18.9,56.68 30.48,45.1 v34.93,45.1
  Bottom 0.152: v34.93,45.1 36.03,45.1 36.57,45.64 38.77,45.64 39.26,45.16 39.24,45.14 IC1.19
D3  (via drill 0.35)
  Top 0.152: LEFT.P$2 14.24,47.55 22.58,39.21 36.66,39.21 36.96,38.91 37.47,38.91 37.82,39.27 37.82,39.77 36.09,41.5 36.09,51.31 36.03,51.37 36.03,51.87 36.38,52.23 36.94,52.23 37.31,51.86 37.31,48.69 37.79,48.2 37.8,48.2 v40.05,45.95 40.05,45.89
  Bottom 0.152: v40.05,45.95 v40.04,45.94 IC1.18
D5  (via drill 0.35)
  Top 0.152: v36.11,52.81 35.72,52.42 35.72,51.24 35.78,51.18 35.78,44.73 35.48,44.42 30.6,44.42 27.48,47.54 RIGHT.P$2
  Bottom 0.152: IC1.31 36.04,52.74 v36.11,52.81
D7
  Bottom 0.152: IC1.1 46.63,54.45 46.3,54.79 46.21,54.79 45.96,55.03 45.96,60.76 43.89,62.83 JP3.1
D8/A8  (via drill 0.35)
  Top 0.152: v38.34,49.91 56.04,49.91 59.02,52.9 59.02,55.83 54.66,60.19 54.62,60.15 Y.P$2
  Bottom 0.152: IC1.28 35.36,50.02 35.89,50.02 35.99,49.91 v38.34,49.91
D9/A10  (via drill 0.35)
  Top 0.152: v38.28,50.89 51.93,50.89 52.17,50.65 53.1,50.65 53.52,51.06 53.52,51.75 52.64,52.62 49.96,52.62 48.4,54.18 48.4,54.56 47.6,55.36 47.6,58.85 55.86,67.1 63.27,67.1 | X.P$2 63.27,67.1 | 63.27,67.1
  Bottom 0.152: IC1.29 35.65,51.14 35.9,50.89 v38.28,50.89
D14  (via drill 0.35)
  Top 0.152: v53.52,48.57 66.08,48.57 69.88,52.37 A.P$2
  Bottom 0.152: IC1.11 48.3,46.34 50.53,48.57 v53.52,48.57 53.58,48.57
D16  (via drill 0.35)
  Top 0.152: v47.97,47.17 49.66,47.17 50.6,48.11 53.01,48.11 55.65,45.46 55.68,45.48 B.P$2
  Bottom 0.152: IC1.10 47.94,47.14 v47.97,47.17
D+  (via drill 0.35)
  Top 0.152: v28.8,3.7 28.8,6.29 21.97,13.12 21.97,30.86 v22.86,31.75 | v27.25,53.08 27.25,56.25 v29.72,58.72
  Bottom 0.152: USBC1.A6 29.56,5.96 29.56,5.38 28.95,4.77 28.93,4.77 USBC1.B6 28.8,4.74 v28.8,3.7 | v22.86,31.75 22.86,33.42 22.71,33.57 22.71,48.54 v27.25,53.08 | v29.72,58.72 30.33,59.33 30.33,61.16 28.95,62.53 S2.1
D-  (via drill 0.35)
  Top 0.152: v29.87,3.7 29.87,6.14 29.93,6.14 | v29.11,6.97 29.93,6.14 | 29.93,6.14 32.92,6.14 39.47,12.7 43.89,12.7 51.81,20.62 51.81,22.91 52.91,24 52.91,36.93 52.49,37.35 | 52.24,37.6 52.49,37.35 | 52.49,37.35 | v26.97,60.09 29.26,60.09 30.66,58.69 31.09,58.69 36.57,53.2 37.06,53.2 37.37,52.9 37.37,52.29 37.61,52.04 37.61,49.36 39.68,47.29 44.8,47.29 50.66,41.44 50.66,39.18 52.49,37.35
  Bottom 0.152: v29.87,3.7 29.87,4.74 USBC1.B7 | v29.11,6.97 29.11,6.11 USBC1.A7 | v26.97,60.09 26.97,61.16 25.6,62.53 23.47,62.53 S2.4
GND  (via drill 0.35)
  Top 0.305: B.P$1 58.73,37.81 v58.7,37.78 | A.P$1 74.23,45.1 75.65,45.1 | Y.P$1 53.21,52.65 v54.37,52.65 | X.P$1 66.3,59.34 64.98,58.02 | UP.P$1 15.79,49.76 v15.79,48.51 | LEFT.P$1 5.66,38.34 6.16,37.84 v6.22,37.84 | DOWN.P$1 13.84,31.36 13.84,30.16 | RIGHT.P$1 25,40.28 v29.56,40.28 | START.P$2 32.73,26.87 32.73,28.54 33.27,29.08 33.84,29.08 33.85,29.06 34.93,29.06 35.84,28.15 35.84,28.03 v35.9,28.03 | SELECT.P$2 47.11,26.64 42.49,31.26 v42.43,31.26 | v33.28,13.7 34.26,12.73 34.26,8.64 32.82,7.21 v32.82,6.91 | v43.46,38.76 v43.46,42.17 45.84,42.17 v46.69,43.02 | v39.93,57.9 v39.93,60.09 | v41.57,17.85 43.65,15.77 v43.71,15.77
  Bottom 0.152: IC1.5 49.7,51.14 C4.2 | U$3.5 31.3,22.83 31.3,22.58 32.74,21.14 33.34,21.14
  Bottom 0.305: USBC1.B12 32.34,4.86 32.34,5.34 32.13,5.55 USBC1.A1 | USBC1.B1 26.43,4.86 26.43,5.34 26.63,5.55 USBC1.A12 | v39.01,31.14 v41.02,31.14 | v43.71,15.77 45.41,14.07 v45.41,12.66
  other vias: 54.98,61.68 44.86,59.24 37.12,21.08 34.62,18.88 26.39,27.54 71.87,54.42 66.2,54.73 23.22,6.87
  pour Top: 19.69,-6.48 55.9,-6.48 89.12,26.75 89.12,63.51 75.53,77.1 5.42,77.1 -6.34,65.33 -6.34,34.98 12.56,16.08 12.56,0.66
  pour Bottom: 4.51,78.5 75.95,78.5 90.58,63.87 90.58,25.47 56.33,-8.79 20.05,-8.79 10.61,0.66 10.61,15.59 -8.54,34.73 -8.54,65.46
L-OUT
  Bottom 0.152: L-OUT.1 21.33,31.59 21.33,39.43 21.94,40.04 21.94,48.66 29.56,56.28 30.33,56.28 31.39,57.35 31.39,60.7 33.53,62.83 37.95,62.83 JP4.1
N$1
  Bottom 0.152: S2.6 23.32,57.65 19.51,61.46 19.51,63.14 RPI-D-.1
N$2
  Bottom 0.152: S2.3 28.8,57.5 25.6,57.5 24.69,56.59 22.1,56.59 21.33,57.35 21.33,58.87 17.37,62.83 17.37,63.14 RPI-D+.1
N$11  (via drill 0.35)
  Top 0.152: v52.85,51.25 51.27,51.25 50.9,51.25 50.47,51.68 38.59,51.68 38.22,52.04 37.73,52.53 37.73,53.14 37.25,53.63 37.12,53.75 36.51,53.75 31.03,59.24 30.57,59.24 29.11,60.7 15.09,60.7 v14.48,61.31
  Bottom 0.152: v52.85,51.25 59.28,51.25 BF998E6327HTSA1.2 | v14.48,61.31 13.1,62.68 13.1,63.14 GND-B.1
N$12
  Bottom 0.152: BF998E6327HTSA1.4 61.26,53.23 61.26,59.48 61.11,59.63 MMBT9015C.2
N$13
  Bottom 0.152: R4.2 59.13,62.23 59.13,59.79 MMBT9015C.1
N$14
  Bottom 0.152: T1.4 67.36,57.04 67.36,57.35 66.29,58.42 12K.2
N$15
  Bottom 0.152: 67.36,60.85 67.36,59.79 66.9,59.33 65.68,59.33 65.38,59.02 65.38,57.81 66.75,56.43 68.58,56.43 68.88,56.74 68.88,56.89 T1.6 | 67.36,60.85 67.51,61.01 68.73,61.01 69.19,60.55 | 69.19,60.55 69.34,60.4 69.34,59.33 70.1,58.57 R1.1 | 67.36,60.85 65.99,62.23 60.81,62.23 R4.1 | 69.19,60.55 72.54,63.9 74.06,63.9 C3.2
N$16
  Bottom 0.152: T1.2 68.27,55.06 68.27,53.54 R6.1
N$17
  Bottom 0.152: 69.49,55.37 69.49,54.15 69.04,53.69 69.04,52.62 68.27,51.86 R6.2 | 69.49,55.37 69.49,57.5 69.34,57.65 69.34,58.72 68.27,59.79 68.27,60.09 R5.2 | 69.49,55.37 78.94,55.37 SW3.1
N$18
  Bottom 0.152: T1.5 68.27,57.04 68.27,58.42 R5.1
N$19
  Bottom 0.152: U$3.8 29.72,23.67 29.72,20.77 29.26,20.32 R13.1
N$20
  Bottom 0.152: U$3.4 31.7,22.91 33.68,22.91 35.05,21.53 C9.1 35.2,21.38 35.36,21.23 35.36,14.83 34.59,14.07 34.59,9.95 R15.2
N$21
  Bottom 0.152: R11.2 8.84,56.59 8.84,58.26 U$1.OUT.R+
N$22  (via drill 0.35)
  Top 0.152: v49.99,25.95 43.04,32.9 v40.69,32.9 | v29.41,37.23 21.64,37.23 v19.35,39.52
  Bottom 0.152: 40.54,1.57 46.02,1.57 J1.4 | 40.54,1.57 38.56,1.57 J1.1 | 9.6,31.75 5.03,36.32 5.03,40.43 U$1.GND | 9.6,31.75 18.29,40.43 U$1.IN.COM 18.44,40.43 v19.35,39.52 | 9.6,31.75 GND.1 | 40.54,1.57 40.54,15.71 44.44,19.61 44.44,20.65 48.95,25.16 49.19,25.16 v49.99,25.95 | v40.69,32.9 33.28,32.9 29.41,36.77 v29.41,37.23
N$23  (via drill 0.35)
  Top 0.152: v25.6,25.34 v23.47,27.48
  Bottom 0.152: v23.47,27.48 21.27,27.48 19.38,29.37 19.38,31.93 20.72,33.27 20.72,40.43 U$1.IN.L | v25.6,25.34 25.6,22.45 28.8,19.25 31.85,19.25 32.15,18.94 32.15,16.81 32,16.66 30.17,16.66 30.02,16.81 28.8,16.81 28.5,16.51 28.5,15.29 26.97,13.76 23.93,13.76 23.62,13.46 23.62,11.48 23.96,11.14 28.19,11.14 30.91,8.43 37.49,8.43 38.4,9.34 J1.11
N$24  (via drill 0.35)
  Top 0.152: v17.07,41.19 17.07,40.89 21.49,36.47 v30.63,36.47 | v42.37,33.57 42.82,33.57 49.83,26.56 50.29,26.56 50.72,26.14 v50.72,24.83
  Bottom 0.152: v17.07,41.19 16.46,40.58 15.85,40.58 U$1.IN.R | v30.63,36.47 33.53,33.57 v42.37,33.57 | v50.72,24.83 50.72,21.35 46.18,16.81 46.18,10.56 J1.10
N$25  (via drill 0.35)
  Top 0.152: v41.15,13.3 41.15,16.96 37.76,20.35 37.76,24.19 v33.56,28.39 | v20.69,29.15 20.27,29.15 18.13,31.29 v16.91,31.29
  Bottom 0.152: v41.15,13.3 46.02,8.43 46.02,8.12 J1.2 | v33.56,28.39 32.4,28.39 31.21,29.58 21.12,29.58 v20.69,29.15 | v16.91,31.29 15.7,31.29 15.54,31.44 R-IN.1
N$26  (via drill 0.35)
  Top 0.152: v24.99,27.02 24.99,28.7 v23.32,30.37 | v19.2,36.16 v21.94,33.42
  Bottom 0.152: v24.99,27.02 24.99,23.21 22.4,20.62 22.4,6.29 25.6,3.09 33.22,3.09 34.44,4.31 38.4,4.31 J1.3 | v23.32,30.37 22.25,31.44 22.25,33.12 v21.94,33.42 | v19.2,36.16 17.22,36.16 12.8,31.75 L-IN.1
N$27
  Bottom 0.152: R10.2 17.68,56.59 17.68,58.26 U$1.OUT.L+
N$28  (via drill 0.35)
  Top 0.152: v51.51,24.13 51.51,25.8 48,29.31 47.79,29.31 v42.43,34.67 | v32,36.01 29.23,38.79 21.91,38.79 v14.63,46.07
  Bottom 0.152: R11.1 8.69,54.76 8.69,43.33 6.4,41.04 6.4,40.13 7.16,39.37 7.92,39.37 v14.63,46.07 17.68,49.12 17.68,54.76 R10.1 | SPK+.1 50.29,20.47 51.51,21.69 v51.51,24.13 | v42.43,34.67 33.34,34.67 v32,36.01
N$29  (via drill 0.35)
  Top 0.152: v7.62,56.89 7.62,54.76 22.86,39.52 v37.21,39.52 | v51.45,34.73 52.12,34.06 52.12,23.67 49.68,21.23 v49.68,19.4
  Bottom 0.152: v7.62,56.89 6.25,58.26 U$1.OUT.R- | v51.45,34.73 46.66,39.52 v37.21,39.52 | v49.68,19.4 49.68,12.39 48.77,11.48 48.77,9.34 50.29,7.82 SPK-.1
N$30
  Bottom 0.152: R2.2 29.56,16.05 31.09,16.05 IC2.6
N$31
  Bottom 0.152: R3.2 29.56,17.72 30.63,17.72 31.09,17.27 IC2.7
N$32
  Bottom 0.152: LEDG1.C 25.14,16.05 25.6,16.05 26.21,16.66 27.13,16.66 27.74,16.05 R2.1
N$33  (via drill 0.35)
  Top 0.152: v30.02,26.56 40.02,36.56 v51.78,36.56
  Bottom 0.152: v30.02,26.56 31.39,26.56 32.76,25.19 32.76,24.58 32.61,24.43 30.94,24.43 U$3.2 | v51.78,36.56 62.48,36.56 66.51,40.58 69.49,40.58 L2.2
N$34
  Bottom 0.152: LEDR1.C 26.67,17.88 27.74,17.88 R3.1
N$35  (via drill 0.35)
  Top 0.152: v33.07,19.49 34.04,19.49 v37.15,22.6
  Bottom 0.152: v33.07,19.49 33.07,20.16 30.63,22.6 30.63,22.91 U$3.6 | 37.15,23.33 v37.15,22.6 | 37.15,23.33 37.34,23.52 40.08,23.52 40.38,23.21 42.55,23.21 43.58,22.17 43.58,20.96 R16.2 42.37,19.86 | C7.2 23.62,24.89 23.62,26.56 25.36,28.3 31.03,28.3 34.75,24.58 R17.1 34.9,24.43 35.81,24.43 37.03,23.21 37.09,23.27 37.15,23.33
N$36
  Bottom 0.152: R8.2 36.73,17.11 IC2.2
N$37
  Bottom 0.152: U1.3 44.35,27.17 45.11,27.17 45.57,26.72 46.94,26.72 47.24,27.02 47.24,28.7 46.79,29.15 46.33,29.15 U3.3
N$38
  Bottom 0.152: U3.1 46.18,27.48 45.87,27.48 45.11,28.24 45.11,28.7 44.65,29.15 44.35,29.15 U1.1
N$39
  Bottom 0.152: R12.2 43.13,24.89 42.82,24.89 40.99,26.72 40.69,26.72 40.54,26.87 40.54,29.61 40.69,29.76 44.96,29.76 45.41,29.31 45.41,28.85 45.87,28.39 46.18,28.39 U3.2
N$40
  Bottom 0.152: 12K.1 66.14,60.09 65.68,59.63 65.53,59.63 65.07,59.18 65.07,53.08 67.51,50.64 69.04,50.64 70.1,51.71 23K.2 70.25,51.71 71.02,50.95 78.94,50.95 RESET.1
N$41
  Bottom 0.152: R7.1 48.31,53.54 48,53.54 47.24,52.78 46.79,52.78 IC1.3
N$42
  Bottom 0.152: R18.1 48.31,52.01 46.79,52.01 IC1.4
N$43
  Bottom 0.152: C12.1 33.07,40.13 39.93,40.13 41.3,41.5 X3.P$1 41.45,41.65 41.6,41.8 41.6,44.39 IC1.16
N$44
  Bottom 0.152: C11.1 33.07,42.41 36.57,42.41 37.34,41.65 X3.P$2 37.49,41.65 38.56,41.65 40.84,43.94 40.84,44.39 IC1.17
N$45
  Bottom 0.152: R19.2 32.61,57.96 34.44,57.96 PWR.A
R-OUT  (via drill 0.35)
  Top 0.152: v31.09,61.31 37.34,61.31 37.64,61.01 38.56,61.01 40.38,62.83 JP4.2
  Bottom 0.152: v31.09,61.31 31.09,57.5 30.17,56.59 29.41,56.59 19.66,46.83 19.66,40.13 19.96,39.82 19.96,36.01 18.59,34.64 18.59,31.59 R-OUT.1
VBUS
  Bottom 0.152: LEDR1.A 25.14,17.72 25.14,17.11 24.38,16.35 24.38,15.44 24.69,15.13 24.61,15.06 22.95,13.4 | 36.77,14.63 36.73,14.68 IC2.4 | USBC1.B4 27.89,4.89 27.89,5.23 28.04,5.38 28.04,5.96 USBC1.A9 28.19,6.11 28.19,6.9 | 30.63,5.84 30.63,5.38 30.78,5.23 30.78,4.89 USBC1.B9 | 30.63,5.84 USBC1.A4 | 30.63,6.29 30.63,5.99 USBC1.A4 | 38.1,12.85 C1.1 | 30.63,6.29 USBC1.A4 | 30.63,6.29 | 30.63,5.84
  Bottom 0.305: USBC1.A9 28.18,6.06 28.18,6.94 | 30.63,6.38 30.63,5.84 | USBC1.A4 30.63,6.38 | 38.1,12.85 38.1,11.94 39.42,10.62 39.43,10.62 39.61,10.44 39.61,8.39 39.43,8.21 39.4,8.21 39.03,7.83 31.97,7.83 30.63,6.5 USBC1.A4 | C1.1 36.77,14.18 36.77,14.63 | 24.61,15.06 24.61,15.15 24.39,15.37 24.39,16.42 25.16,17.19 LEDR1.A 25.95,18.64 30.13,18.64 30.23,18.53 IC2.8 | LEDG1.A 25.83,15.13 24.69,15.13 22.95,13.4 22.95,11.2 24.11,10.04 27.8,10.04 28.19,9.65 28.19,8.46 28.19,8.31 | 28.19,6.9 28.19,8.31 | USBC1.A4 30.63,6.66 29.5,7.79 28.71,7.79 28.19,8.31
VCC
  Bottom 0.152: 33.07,49.27 33.68,49.88 33.68,54.3 35.51,56.13 36.73,56.13 IC1.34 | 33.07,49.27 32.61,49.27 SJ2.1 33.07,49.27 | U3.5 49.07,28.39 51.2,28.39 R9.1 51.36,28.39 51.36,29.31 53.03,30.98 | 53.03,30.98 54.25,30.98 54.41,30.83 54.41,29.31 53.64,28.54 C2.2 | C14.1 33.07,45 33.07,46.99 C13.1 33.07,47.14 | 33.07,47.14 34.9,47.14 IC1.24 | 41.3,47.14 43.13,45.31 43.13,44.55 IC1.14 43.28,44.39 43.28,43.94 53.03,34.18 53.03,30.98 | IC1.24 | 41.3,47.14 44.8,50.64 44.8,56.13 IC1.44 | 33.07,47.14 33.07,49.27 | IC1.24 36.06,47.14 36.76,46.44 39.01,46.44 39.71,47.14 41.3,47.14

### Text on the board
Name: L | R | BNT R/L | Audio